# EAGLE schematic Jig-Middle-Layer (EAGLE 7.6.0)
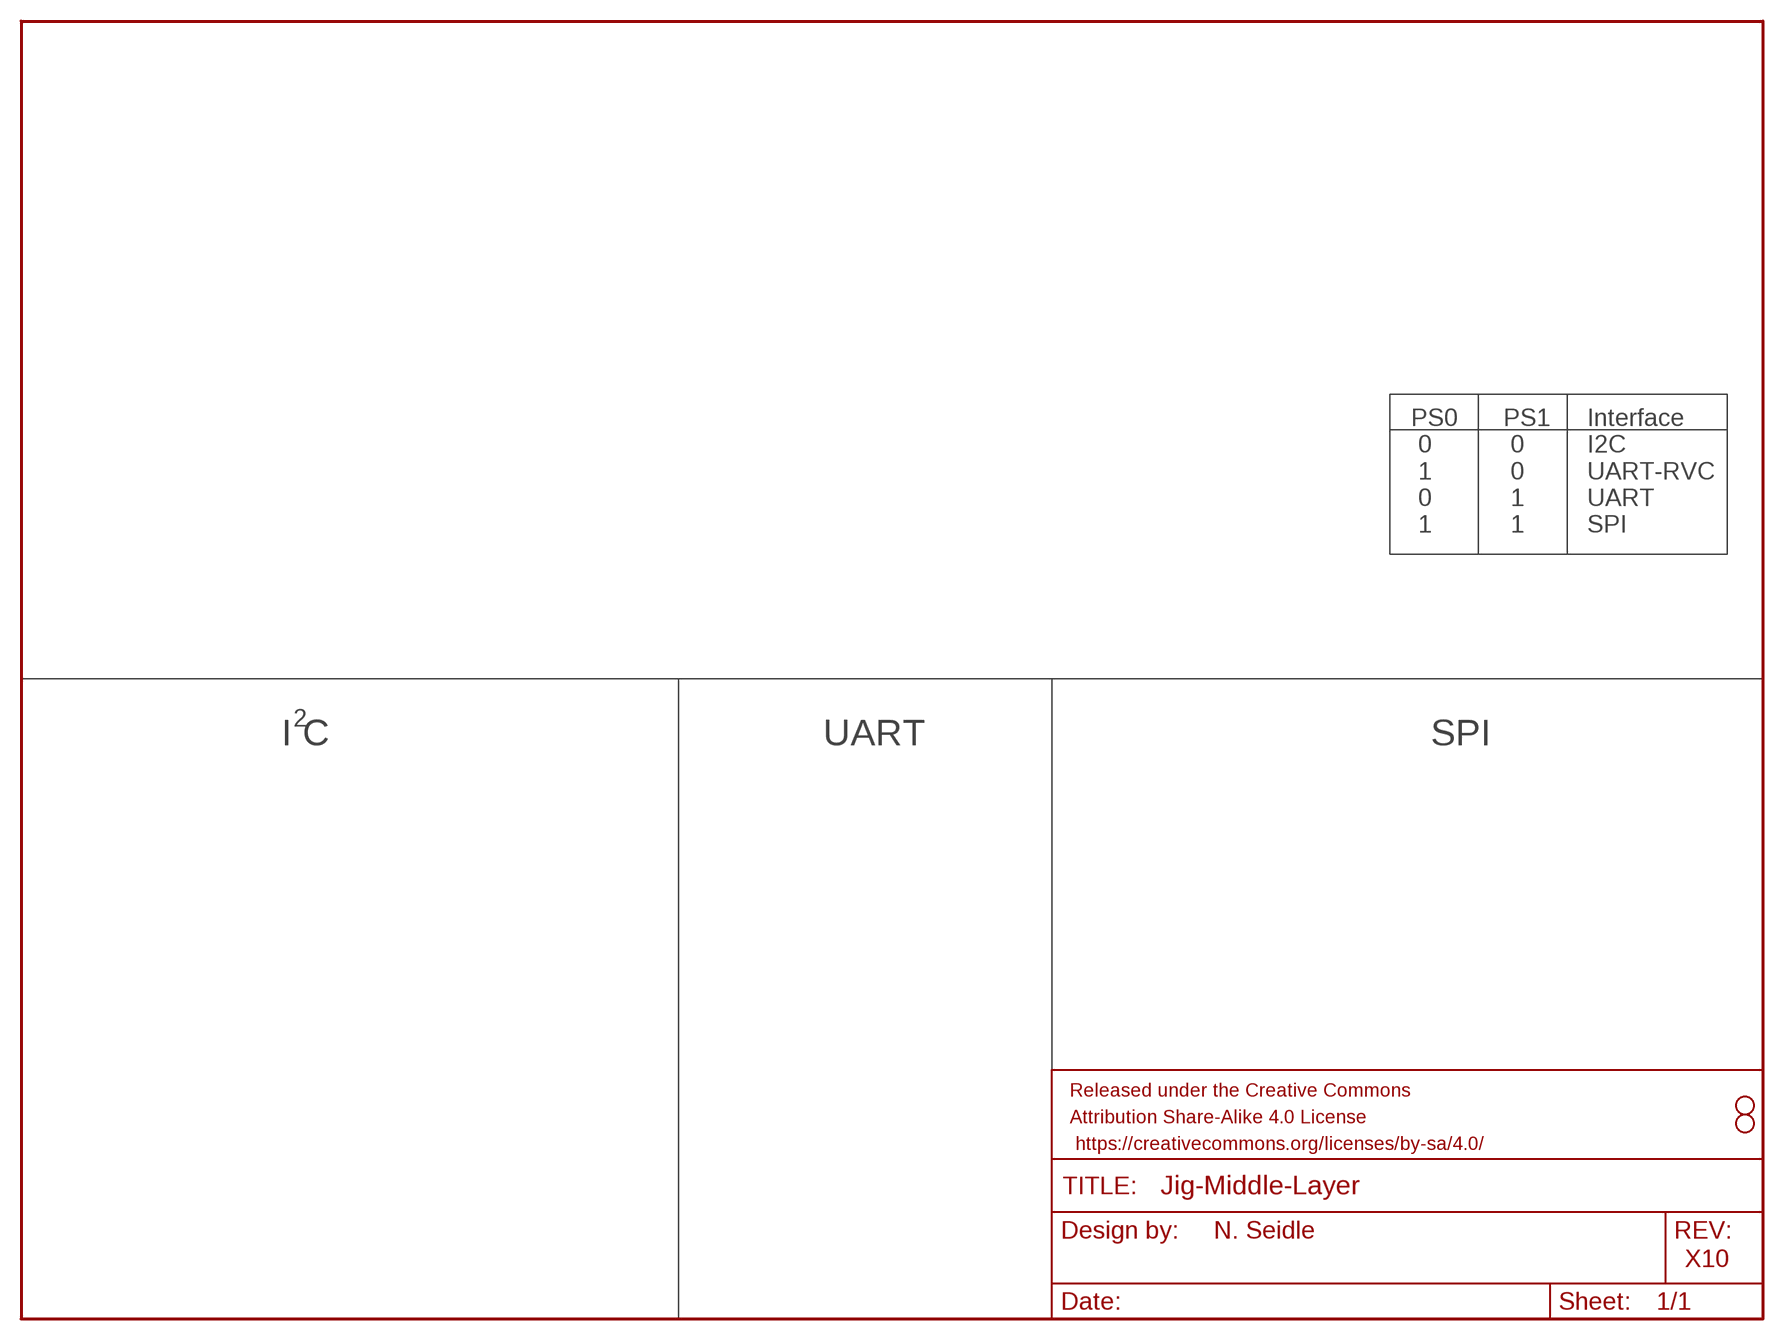
[diagram p0: schematic, sheet 1]

## Parts
FRAME1  FRAME-LETTER  [CREATIVE_COMMONS]
JP3  STAND-OFF  [STAND-OFF]
JP4  STAND-OFF  [STAND-OFF]

## Notes on the sheet
- PS0
   0
   1
   0
   1
- PS1
   0
   0
   1
   1
- Interface
  I2C
  UART-RVC
  UART
  SPI
- 2
- I C | UART | SPI
- N. Seidle
- X10

## Library data of the parts
FRAME1 = SparkFun-Aesthetics:FRAME-LETTER: Schematic Frame - Letter Standard 8.5x11 US Letter frame
JP3 JP4 = SparkFun:STAND-OFF: Stand Off This is the mechanical footprint for a #4 phillips button head screw. Use the keepout ring to avoid running the screw head into surrounding components. SKU : PRT-00447